# Altium schematic sheet Main.SchDoc
size A4
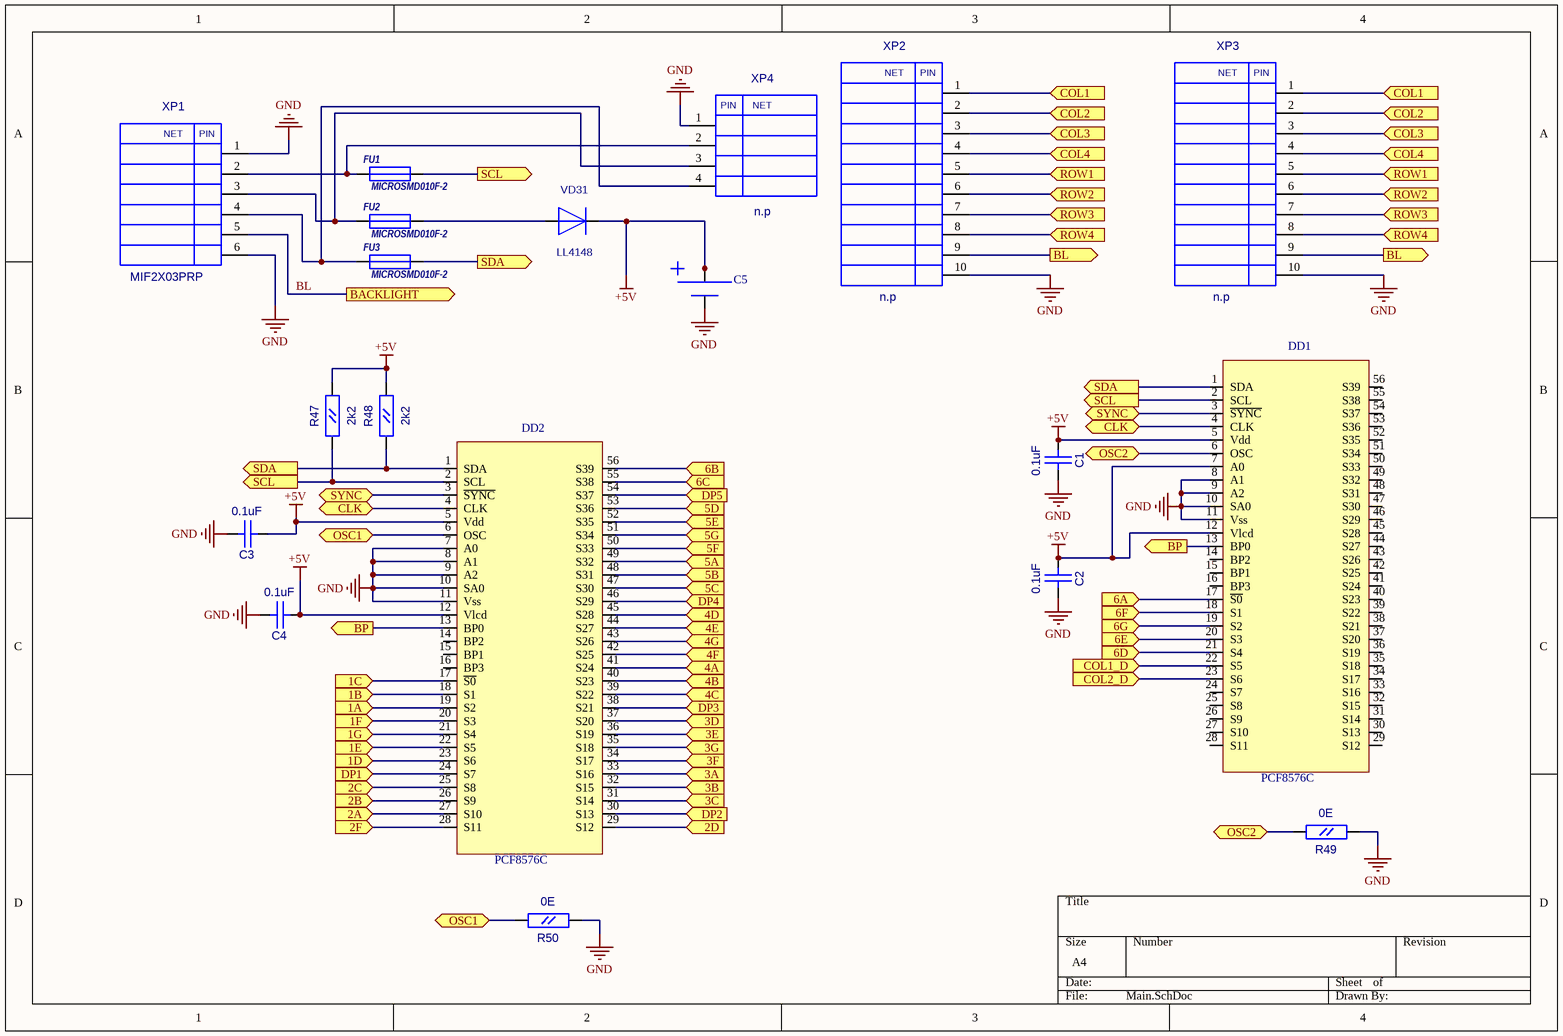
[diagram p0: Main.SchDoc]

## Parts
C1  0.1uF  [CC0603]
C2  0.1uF  [CC0603]
C3  0.1uF  [CC0603]
C4  0.1uF  [CC0603]
C5  EEC-S5R5H105  [CR2032_ONBOARD]  (value not drawn)
DD1  PCF8576C  [SOT190-1]
DD2  PCF8576C  [SOT190-1]
FU1  MICROSMD010F-2  [RC1210]
FU2  MICROSMD010F-2  [RC1210]
FU3  MICROSMD010F-2  [RC1210]
R47  2k2  [RC0603]
R48  2k2  [RC0603]
R49  0E  [RC0603]
R50  0E  [RC0603]
VD31  LL4148  [SOD-80]
XP1  MIF2X03PRP  [MIF2X03PRP]
XP2  n.p  [BH-10]
XP3  n.p  [BH-10]
XP4  n.p  [MIF2X02PRP]

## Ports
1A (in), 1B (in), 1C (in), 1D (in), 1E (in), 1F (in), 1G (in), 2A (in), 2B (in), 2C (in), 2D (in), 2F (in), 3A (in), 3B (in), 3C (in), 3D (in), 3E (in), 3F (in), 3G (in), 4A (in), 4B (in), 4C (in), 4D (in), 4E (in), 4F (in), 4G (in), 5A (in), 5B (in), 5C (in), 5D (in), 5E (in), 5F (in), 5G (in), 6A (in), 6B (in), 6C (in), 6D (in), 6E (in), 6F (in), 6G (in), BACKLIGHT (out), BL (out), BP (out), CLK, COL1 (in), COL1_D (in), COL2 (in), COL2_D (in), COL3 (in), COL4 (in), DP1 (in), DP2 (in), DP3 (in), DP4 (in), DP5 (in), OSC1, OSC2, ROW1 (in), ROW2 (in), ROW3 (in), ROW4 (in), SCL (out), SDA (out), SYNC

## Nets
+5V: C1.1(A) C2.1(A) C3.1(A) C4.1(A) C5.2 C5.3 C5.4 DD1.5(Vdd) DD1.7(A0) DD1.12(Vlcd) DD2.5(Vdd) DD2.12(Vlcd) R47.2(B) R48.2(B) VD31.2(+)
GND: C1.2(B) C2.2(B) C3.2(B) C4.2(B) C5.1 DD1.8(A1) DD1.9(A2) DD1.10(SA0) DD1.11(Vss) DD2.7(A0) DD2.8(A1) DD2.9(A2) DD2.10(SA0) DD2.11(Vss) R49.1(A) R50.1(A) XP1.1 XP1.6 XP2.10 XP3.10 XP4.1
1A: DD2.19(S2) ; port 1A
1B: DD2.18(S1) ; port 1B
1C: DD2.17(~{S0}) ; port 1C
1D: DD2.23(S6) ; port 1D
1E: DD2.22(S5) ; port 1E
1F: DD2.20(S3) ; port 1F
1G: DD2.21(S4) ; port 1G
2A: DD2.27(S10) ; port 2A
2B: DD2.26(S9) ; port 2B
2C: DD2.25(S8) ; port 2C
2D: DD2.29(S12) ; port 2D
2F: DD2.28(S11) ; port 2F
3A: DD2.33(S16) ; port 3A
3B: DD2.32(S15) ; port 3B
3C: DD2.31(S14) ; port 3C
3D: DD2.37(S20) ; port 3D
3E: DD2.36(S19) ; port 3E
3F: DD2.34(S17) ; port 3F
3G: DD2.35(S18) ; port 3G
4A: DD2.41(S24) ; port 4A
4B: DD2.40(S23) ; port 4B
4C: DD2.39(S22) ; port 4C
4D: DD2.45(S28) ; port 4D
4E: DD2.44(S27) ; port 4E
4F: DD2.42(S25) ; port 4F
4G: DD2.43(S26) ; port 4G
5A: DD2.49(S32) ; port 5A
5B: DD2.48(S31) ; port 5B
5C: DD2.47(S30) ; port 5C
5D: DD2.53(S36) ; port 5D
5E: DD2.52(S35) ; port 5E
5F: DD2.50(S33) ; port 5F
5G: DD2.51(S34) ; port 5G
6A: DD1.17(~{S0}) ; port 6A
6B: DD2.56(S39) ; port 6B
6C: DD2.55(S38) ; port 6C
6D: DD1.21(S4) ; port 6D
6E: DD1.20(S3) ; port 6E
6F: DD1.18(S1) ; port 6F
6G: DD1.19(S2) ; port 6G
BL: XP1.5 ; port BACKLIGHT
BL: XP2.9 XP3.9 ; port BL  [a separate net that carries the same name]
BP: DD1.13(BP0) DD2.13(BP0) ; port BP
CLK: DD1.4(CLK) DD2.4(CLK) ; port CLK
COL1: XP2.1 XP3.1 ; port COL1
COL1_D: DD1.22(S5) ; port COL1_D
COL2: XP2.2 XP3.2 ; port COL2
COL2_D: DD1.23(S6) ; port COL2_D
COL3: XP2.3 XP3.3 ; port COL3
COL4: XP2.4 XP3.4 ; port COL4
DP1: DD2.24(S7) ; port DP1
DP2: DD2.30(S13) ; port DP2
DP3: DD2.38(S21) ; port DP3
DP4: DD2.46(S29) ; port DP4
DP5: DD2.54(S37) ; port DP5
OSC1: DD2.6(OSC) R50.2(B) ; port OSC1
OSC2: DD1.6(OSC) R49.2(B) ; port OSC2
ROW1: XP2.5 XP3.5 ; port ROW1
ROW2: XP2.6 XP3.6 ; port ROW2
ROW3: XP2.7 XP3.7 ; port ROW3
ROW4: XP2.8 XP3.8 ; port ROW4
SCL: DD1.2(SCL) DD2.2(SCL) FU1.2 R47.1(A) ; port SCL
SDA: DD1.1(SDA) DD2.1(SDA) FU3.2 R48.1(A) ; port SDA
SYNC: DD1.3(~{SYNC}) DD2.3(~{SYNC}) ; port SYNC
NetFU1_1: FU1.1 XP1.2 XP4.2
NetFU2_1: FU2.1 XP1.3 XP4.3
NetFU2_2: FU2.2 VD31.1(-)
NetFU3_1: FU3.1 XP1.4 XP4.4

Not connected (* = marked no-connect by the designer): DD1 14(BP2) 15(BP1) 16(BP3) 24(S7) 25(S8) 26(S9) 27(S10) 28(S11) 29(S12) 30(S13) 31(S14) 32(S15) 33(S16) 34(S17) 35(S18) 36(S19) 37(S20) 38(S21) 39(S22) 40(S23) 41(S24) 42(S25) 43(S26) 44(S27) 45(S28) 46(S29) 47(S30) 48(S31) 49(S32) 50(S33) 51(S34) 52(S35) 53(S36) 54(S37) 55(S38) 56(S39); DD2 14(BP2) 15(BP1) 16(BP3)

## Notes on the sheet
- (in symbol BH-10) NET; PIN
- (in symbol MIF2X02PRP) PIN; NET
- (in symbol MIF2X03PRP) NET; PIN

## Library data of the parts
C1-C4 = CC0603: Value: 0.1uF
C5 = CR2032-VBY2: Value: EEC-S5R5H105
DD1 DD2 = PCF8576: LCD Controller; Value: PCF8576C
FU1-FU3 = MICROSMD: Value: MICROSMD010F-2
R47-R50 = RC0603
  R47 R48: Value: 2k2
  R49 R50: Value: 0E
XP2 XP3 = BH-10: Value: n.p
XP4 = MIF2X02PRP: Value: n.p
VD31 = LL4148: Value: *
XP1 = MIF2X03PRP: Value: *